# Altium schematic sheet sensors.SchDoc: Your title
size A4; Date: 2017/06/29; DrawnBy: ØÁÔÀöÎ; Revision: Alfa 0.1; SheetNumber: 3; SheetTotal: 6; Time: 19:01
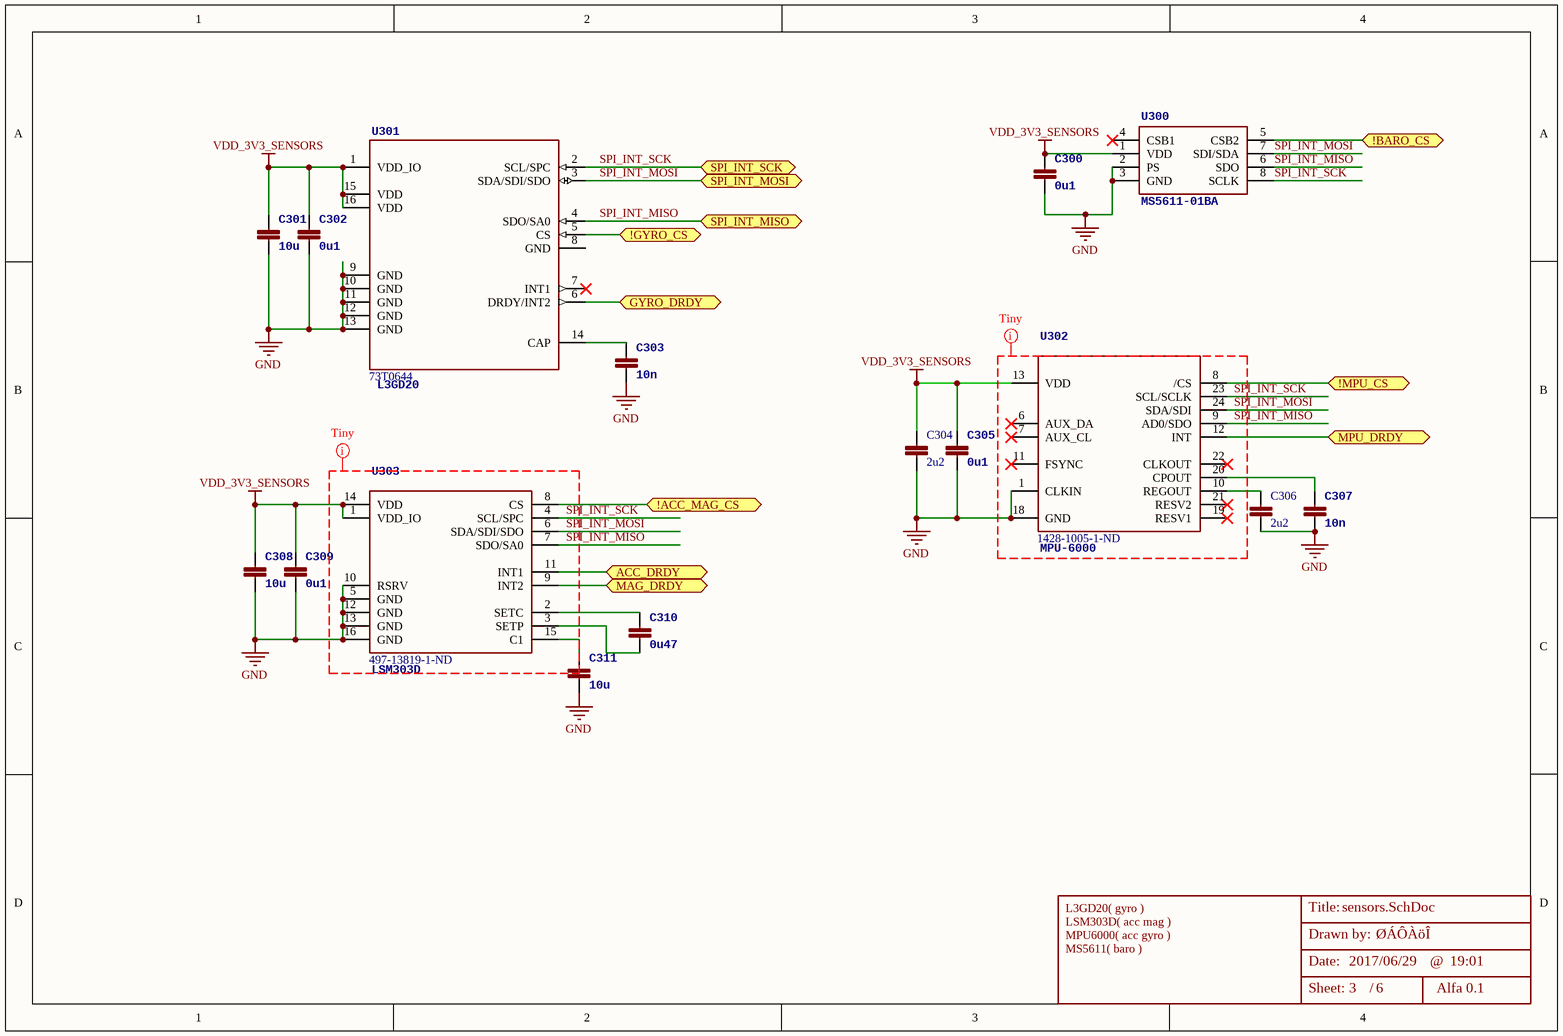
[diagram p0: sensors.SchDoc]

## Parts
C300  0u1  [0603-CAP]
C301  10u  [0603-CAP]
C302  0u1  [0603-CAP]
C303  10n  [0603-CAP]
C304  2u2  [0603-CAP]
C305  0u1  [0603-CAP]
C306  2u2  [0603-CAP]
C307  10n  [0603-CAP]
C308  10u  [0603-CAP]
C309  0u1  [0603-CAP]
C310  0u47  [0603-CAP]
C311  10u  [0603-CAP]
U300  MS5611-01BA  [MS5611-01BA]
U301  L3GD20  Supplier Part Number 1: 73T0644  [L3GD20]
U302  MPU-6000  Supplier Part Number 1: 1428-1005-1-ND  [QFN-24]
U303  LSM303D  Supplier Part Number 1: 497-13819-1-ND  [LSM303D]

## Ports
!ACC_MAG_CS, !BARO_CS, !GYRO_CS, !MPU_CS, ACC_DRDY, GYRO_DRDY, MAG_DRDY, MPU_DRDY, SPI_INT_MISO, SPI_INT_MOSI, SPI_INT_SCK

## Nets
GND: C300.P$2 C301.P$2 C302.P$2 C303.P$2 C304.P$2 C305.P$2 C306.P$2 C307.P$2 C308.P$2 C309.P$2 C311.P$2 U300.2(PS) U300.3(GND) U301.9(GND) U301.10(GND) U301.11(GND) U301.12(GND) U301.13(GND) U302.1(CLKIN) U302.18(GND) U303.5(GND) U303.10(RSRV) U303.12(GND) U303.13(GND) U303.16(GND)
VDD_3V3_SENSORS: C300.P$1 C301.P$1 C302.P$1 C304.P$1 C305.P$1 C308.P$1 C309.P$1 U300.1(VDD) U301.1(VDD_IO) U301.15(VDD) U301.16(VDD) U302.13(VDD) U303.1(VDD_IO) U303.14(VDD)
!ACC_MAG_CS: U303.8(CS) ; port !ACC_MAG_CS
!BARO_CS: U300.5(CSB2) ; port !BARO_CS
!GYRO_CS: U301.5(CS) ; port !GYRO_CS
!MPU_CS: U302.8(/CS) ; port !MPU_CS
ACC_DRDY: U303.11(INT1) ; port ACC_DRDY
GYRO_DRDY: U301.6(DRDY/INT2) ; port GYRO_DRDY
MAG_DRDY: U303.9(INT2) ; port MAG_DRDY
MPU_DRDY: U302.12(INT) ; port MPU_DRDY
SPI_INT_MISO: U300.6(SDO) U301.4(SDO/SA0) U302.9(AD0/SDO) U303.7(SDO/SA0) ; port SPI_INT_MISO
SPI_INT_MOSI: U300.7(SDI/SDA) U301.3(SDA/SDI/SDO) U302.24(SDA/SDI) U303.6(SDA/SDI/SDO) ; port SPI_INT_MOSI
SPI_INT_SCK: U300.8(SCLK) U301.2(SCL/SPC) U302.23(SCL/SCLK) U303.4(SCL/SPC) ; port SPI_INT_SCK
NetC303_P$1: C303.P$1 U301.14(CAP)
NetC306_P$1: C306.P$1 U302.10(REGOUT)
NetC307_P$1: C307.P$1 U302.20(CPOUT)
NetC310_P$1: C310.P$1 U303.2(SETC)
NetC310_P$2: C310.P$2 U303.3(SETP)
NetC311_P$1: C311.P$1 U303.15(C1)

Not connected (* = marked no-connect by the designer): U300 4(CSB1)*; U301 7(INT1)* 8(GND); U302 2(NC1) 3(NC2) 4(NC3) 5(NC4) 6(AUX_DA)* 7(AUX_CL)* 11(FSYNC)* 14(NC5) 15(NC6) 16(NC7) 17(NC8) 19(RESV1)* 21(RESV2)* 22(CLKOUT)*

## Layout directives
net class Tiny_componet: SPI_INT_MISO, SPI_INT_MOSI, SPI_INT_SCK

## Notes on the sheet
- L3GD20( gyro )
- LSM303D( acc mag )
- MPU6000( acc gyro )
- MS5611( baro )
- Title:
- Date:
- Drawn by:
- @
- Sheet:       /

## Library data of the parts
C300-C311 = CAP0603: CAP CER 2.2UF 16V 10% X6S 0603; PARTNO: C1608X6S1C225K080AC; 3DR_PARTNO: ECM0619; Supplier 1: Digi-Key; Supplier Part Number 1: 445-7438-1-ND
  C300 C302 C305 C309: Value: 0u1
  C301 C308 C311: Value: 10u
  C303 C307: Value: 10n
  C304 C306: Value: 2u2
  C310: Value: 0u47
U300 = MS5611-01BA: Board Mount Pressure Sensors; 3DR_PARTNO: ECM0835; Value: 10-1200mbar; DATASHEET: http://www.meas-spec.com/downloads/MS5611-01BA01.pdf; LINK: http://www.meas-spec.com/product/t_product.aspx?id=8503#; MFGPN: MS5611-01BA; PARTNO: MS5611-01BA; Supplier 1: Mouser; Supplier Part Number 1: 824-MS561101BA03-50
U301 = L3GD20: Sensor, Low-power, Three-axis, Angular rate; 3DR_PARTNO: ECM0827; MFGPN: L3GD20; Supplier 1: Newark
U302 = MPU-6000: GYRO/ACCELEROMETER 6AXIS 24QFN; 3DR_PARTNO: ECM0834; DATASHEET: http://invensense.com/mems/gyro/documents/PS-MPU-6000A-00_v1.0.pdf; LINK: http://invensense.com/mems/gyro/mpu6000.html; MFGPN: MPU-6000; Supplier 1: Digi-Key; PARTNO: MPU-6000
U303 = LSM303D: Module, 3D Accelerometer, 3D Magnetometer; 3DR_PARTNO: ECM0828; DATASHEET: http://www.st.com/internet/com/TECHNICAL_RESOURCES/TECHNICAL_LITERATURE/DATASHEET/DM00057547.pdf; LINK: http://www.st.com/internet/analog/product/253884.jsp; MFGPN: LSM303D; Supplier 1: Digi-Key